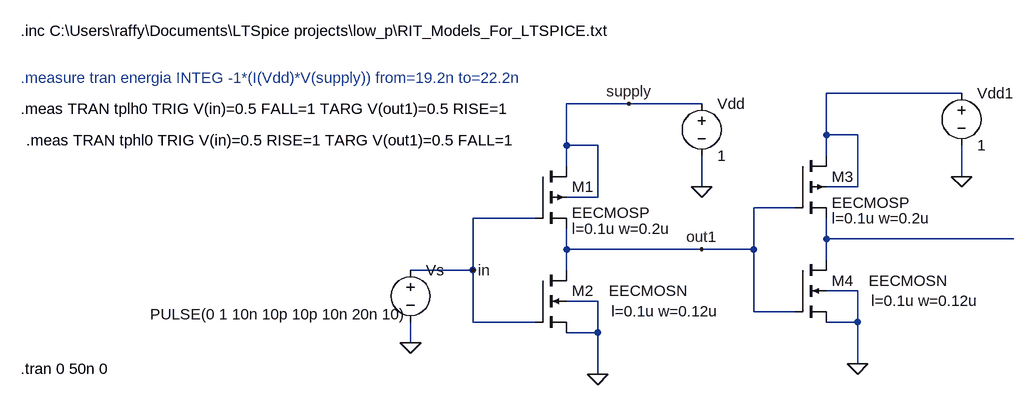
[diagram p0: schematic min_size_inv.asc]
min_size_inv.asc, the LTspice schematic file:
Version 4
SHEET 1 880 680
WIRE 224 128 16 128
WIRE -288 144 -384 144
WIRE -176 144 -288 144
WIRE 16 192 16 128
WIRE 64 192 16 192
WIRE -384 208 -384 144
WIRE -336 208 -384 208
WIRE 16 224 16 192
WIRE -384 240 -384 208
WIRE 224 256 224 208
WIRE -176 272 -176 224
WIRE 64 272 64 192
WIRE 64 272 16 272
WIRE -336 288 -336 208
WIRE -336 288 -384 288
WIRE -32 304 -96 304
WIRE -432 320 -528 320
WIRE 16 352 16 320
WIRE 304 352 16 352
WIRE -384 368 -384 336
WIRE -176 368 -384 368
WIRE -96 368 -96 304
WIRE -96 368 -176 368
WIRE 16 384 16 352
WIRE -528 400 -528 320
WIRE -528 400 -624 400
WIRE -384 400 -384 368
WIRE 64 432 16 432
WIRE -336 448 -384 448
WIRE -96 464 -96 368
WIRE -32 464 -96 464
WIRE -528 480 -528 400
WIRE -432 480 -528 480
WIRE 64 480 64 432
WIRE 64 480 16 480
WIRE -336 496 -336 448
WIRE -336 496 -384 496
WIRE -624 512 -624 480
WIRE 64 544 64 480
WIRE -336 560 -336 496
FLAG -624 512 0
FLAG -528 400 in
FLAG -176 368 out1
FLAG -288 144 supply
FLAG -336 560 0
FLAG -176 272 0
FLAG 64 544 0
FLAG 224 256 0
SYMBOL pmos4 -432 240 R0
WINDOW 123 56 96 Left 2
SYMATTR InstName M1
SYMATTR Value EECMOSP
SYMATTR Value2 l=0.1u w=0.2u
SYMBOL nmos4 -432 400 R0
WINDOW 3 113 32 Left 2
WINDOW 123 117 63 Left 2
SYMATTR InstName M2
SYMATTR Value EECMOSN
SYMATTR Value2 l=0.1u w=0.12u
SYMBOL voltage -176 128 R0
SYMATTR InstName Vdd
SYMATTR Value 1
SYMBOL voltage -624 384 R0
WINDOW 3 -401 84 Left 2
WINDOW 123 0 0 Left 0
WINDOW 39 0 0 Left 0
SYMATTR InstName Vs
SYMATTR Value PULSE(0 1 10n 10p 10p 10n 20n 10)
SYMBOL pmos4 -32 224 R0
WINDOW 123 56 96 Left 2
SYMATTR InstName M3
SYMATTR Value EECMOSP
SYMATTR Value2 l=0.1u w=0.2u
SYMBOL nmos4 -32 384 R0
WINDOW 3 113 32 Left 2
WINDOW 123 117 63 Left 2
SYMATTR InstName M4
SYMATTR Value EECMOSN
SYMATTR Value2 l=0.1u w=0.12u
SYMBOL voltage 224 112 R0
SYMATTR InstName Vdd1
SYMATTR Value 1
TEXT -1224 32 Left 2 !.inc C:\\Users\\raffy\\Documents\\LTSpice projects\\low_p\\RIT_Models_For_LTSPICE.txt
TEXT -1224 552 Left 2 !.tran 0 50n 0
TEXT -1224 104 Left 2 ;.measure tran energia INTEG -1*(I(Vdd)*V(supply)) from=19.2n to=22.2n
TEXT -1224 152 Left 2 !.meas TRAN tplh0 TRIG V(in)=0.5 FALL=1 TARG V(out1)=0.5 RISE=1
TEXT -1216 200 Left 2 !.meas TRAN tphl0 TRIG V(in)=0.5 RISE=1 TARG V(out1)=0.5 FALL=1

The netlist it stands for:
* min_size_inv.asc
M1 supply in out1 supply EECMOSP l=0.1u w=0.2u
M2 out1 in 0 0 EECMOSN l=0.1u w=0.12u
Vdd supply 0 1
Vs in 0 PULSE(0 1 10n 10p 10p 10n 20n 10)
M3 N001 out1 N002 N001 EECMOSP l=0.1u w=0.2u
M4 N002 out1 0 0 EECMOSN l=0.1u w=0.12u
Vdd1 N001 0 1
.model NMOS NMOS
.model PMOS PMOS
.lib standard.mos
.inc C:\Users\raffy\Documents\LTSpice projects\low_p\RIT_Models_For_LTSPICE.txt
.tran 0 50n 0
* .measure tran energia INTEG -1*(I(Vdd)*V(supply)) from=19.2n to=22.2n
.meas TRAN tplh0 TRIG V(in)=0.5 FALL=1 TARG V(out1)=0.5 RISE=1
.meas TRAN tphl0 TRIG V(in)=0.5 RISE=1 TARG V(out1)=0.5 FALL=1
.backanno
.end